# EAGLE design Micro DAQ Board.5 (EAGLE 5.06)
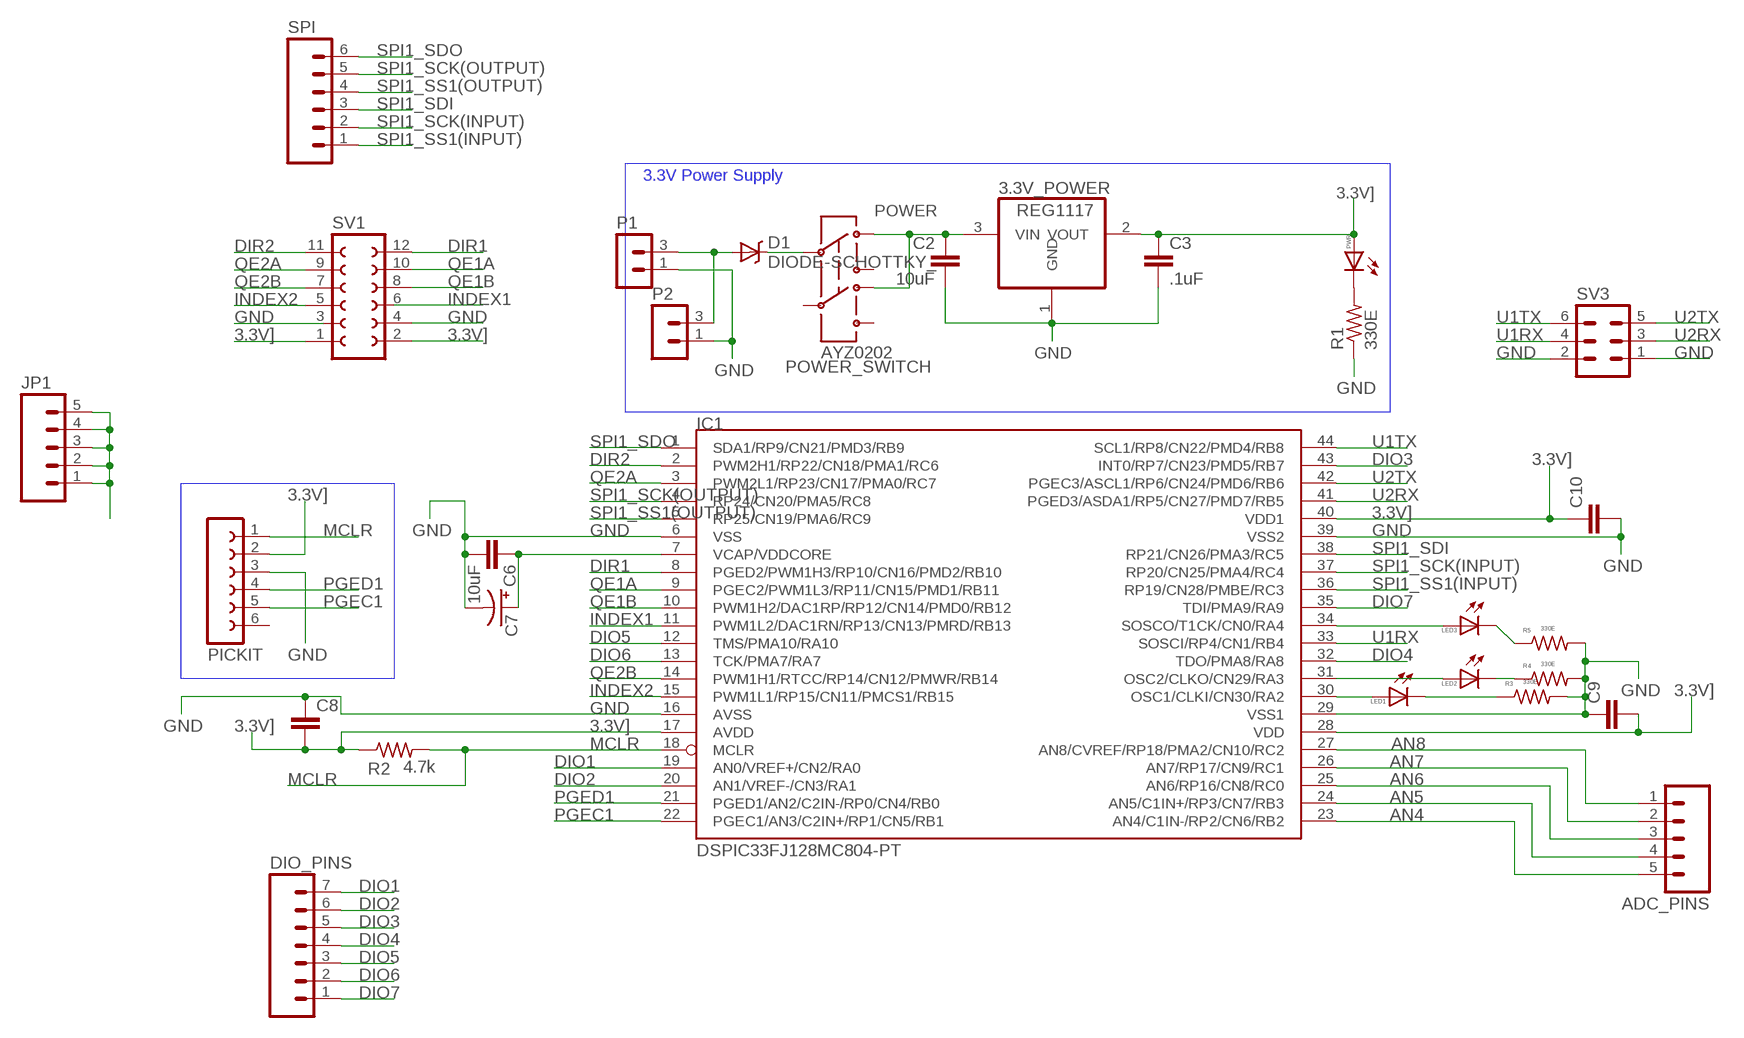
[diagram p0: schematic, sheet 1]

## Parts
3.3V_POWER  REG1117  [SOT223]
ADC_PINS  M05PTH_LONGPADS  [1X05_LONGPADS]
C2  10uF  C-EUC0805  [C0805]
C3  .1uF  C-EUC0805  [C0805]
C6  10uF  C-EUC0805  [C0805]
C7  CPOL-USE2.5-6  [E2,5-6]
C8  C-EUC0805  [C0805]
C9  C-EUC0805  [C0805]
C10  C-EUC0805  [C0805]
D1  DIODE-SCHOTTKY_  [SMA-DIODE]
DIO_PINS  M07LOCK_LONGPADS  [1X07_LOCK_LONGPADS]
IC1  DSPIC33FJ128MC804-PT  [TQFP44]
JP1  M05PTH_LONGPADS  [1X05_LONGPADS]
LED1  LEDCHIPLED_0805  [CHIPLED_0805]
LED2  LEDCHIPLED_0805  [CHIPLED_0805]
LED3  LEDCHIPLED_0805  [CHIPLED_0805]
P1  MA02-1  [MA02-1]
P2  MA02-1  [MA02-1]
PICKIT  FE06-1  [FE06]
POWER_SWITCH  AYZ0202  [AYZ0202]
PWR  LEDCHIPLED_0805  [CHIPLED_0805]
R1  330E  R-US_R0805  [R0805]
R2  4.7k  R-US_R0805  [R0805]
R3  330E  R-US_R0805  [R0805]
R4  330E  R-US_R0805  [R0805]
R5  330E  R-US_R0805  [R0805]
SPI  M06LONGPADS  [1X06_LONGPADS]
SV1  FE06-2  [FE06-2]
SV3  ML6  [ML6]

## Nets
3.3V]: 3.3V_POWER.2(VOUT) C3.1 C8.2 C9.2 C10.1 IC1.17(AVDD) IC1.28(VDD) IC1.40(VDD1) PICKIT.2 PWR.A R2.1 SV1.1 SV1.2
AN4: ADC_PINS.5 IC1.23(AN4/C1IN-/RP2/CN6/RB2)
AN5: ADC_PINS.4 IC1.24(AN5/C1IN+/RP3/CN7/RB3)
AN6: ADC_PINS.3 IC1.25(AN6/RP16/CN8/RC0)
AN7: ADC_PINS.2 IC1.26(AN7/RP17/CN9/RC1)
AN8: ADC_PINS.1 IC1.27(AN8/CVREF/RP18/PMA2/CN10/RC2)
DIO1: DIO_PINS.7 IC1.19(AN0/VREF+/CN2/RA0)
DIO2: DIO_PINS.6 IC1.20(AN1/VREF-/CN3/RA1)
DIO3: DIO_PINS.5 IC1.43(INT0/RP7/CN23/PMD5/RB7)
DIO4: DIO_PINS.4 IC1.32(TDO/PMA8/RA8)
DIO5: DIO_PINS.3 IC1.12(TMS/PMA10/RA10)
DIO6: DIO_PINS.2 IC1.13(TCK/PMA7/RA7)
DIO7: DIO_PINS.1 IC1.35(TDI/PMA9/RA9)
DIR1: IC1.8(PGED2/PWM1H3/RP10/CN16/PMD2/RB10) SV1.12
DIR2: IC1.2(PWM2H1/RP22/CN18/PMA1/RC6) SV1.11
GND: 3.3V_POWER.1(GND) C2.2 C3.2 C6.2 C7.- C8.1 C9.1 C10.2 IC1.6(VSS) IC1.16(AVSS) IC1.29(VSS1) IC1.39(VSS2) JP1.1 JP1.2 JP1.3 JP1.4 JP1.5 P1.1 P2.1 PICKIT.3 R1.1 R3.2 R4.2 R5.2 SV1.4 SV3.1 SV3.2
INDEX1: IC1.11(PWM1L2/DAC1RN/RP13/CN13/PMRD/RB13)
INDEX2: IC1.15(PWM1L1/RP15/CN11/PMCS1/RB15) SV1.5
MCLR: IC1.18(MCLR) PICKIT.1 R2.2
N$1: IC1.30(OSC1/CLKI/CN30/RA2) LED1.A
N$2: LED1.C R3.1
N$3: IC1.31(OSC2/CLKO/CN29/RA3) LED2.A
N$4: LED2.C R4.1
N$5: LED3.C R5.1
N$6: IC1.34(SOSCO/T1CK/CN0/RA4) LED3.A
N$7: D1.A P1.3 P2.3
N$8: D1.C POWER_SWITCH.2
N$15: PWR.C R1.2
PGEC1: IC1.22(PGEC1/AN3/C2IN+/RP1/CN5/RB1) PICKIT.5
PGED1: IC1.21(PGED1/AN2/C2IN-/RP0/CN4/RB0) PICKIT.4
POWER: 3.3V_POWER.3(VIN) C2.1 POWER_SWITCH.3 POWER_SWITCH.6
QE1A: IC1.9(PGEC2/PWM1L3/RP11/CN15/PMD1/RB11) SV1.10
QE1B: IC1.10(PWM1H2/DAC1RP/RP12/CN14/PMD0/RB12) SV1.8
QE2A: IC1.3(PWM2L1/RP23/CN17/PMA0/RC7) SV1.9
QE2B: IC1.14(PWM1H1/RTCC/RP14/CN12/PMWR/RB14) SV1.7
SPI1_SCK(INPUT): IC1.37(RP20/CN25/PMA4/RC4) SPI.2
SPI1_SCK(OUTPUT): IC1.4(RP24/CN20/PMA5/RC8) SPI.5
SPI1_SDI: IC1.38(RP21/CN26/PMA3/RC5) SPI.3
SPI1_SDO: IC1.1(SDA1/RP9/CN21/PMD3/RB9) SPI.6
SPI1_SS1(INPUT): IC1.36(RP19/CN28/PMBE/RC3) SPI.1
SPI1_SS1(OUTPUT): IC1.5(RP25/CN19/PMA6/RC9) SPI.4
U1RX: IC1.33(SOSCI/RP4/CN1/RB4) SV3.4
U1TX: IC1.44(SCL1/RP8/CN22/PMD4/RB8) SV3.6
U2RX: IC1.41(PGED3/ASDA1/RP5/CN27/PMD7/RB5) SV3.3
U2TX: IC1.42(PGEC3/ASCL1/RP6/CN24/PMD6/RB6) SV3.5
VCAP/VDDCORE: C6.1 C7.+ IC1.7(VCAP/VDDCORE)
Unconnected: PICKIT.6 POWER_SWITCH.1 POWER_SWITCH.4 POWER_SWITCH.5 SV1.3 SV1.6

## Notes on the sheet
- 3.3V Power Supply

## Library data of the parts
3.3V_POWER = burr-brown:REG1117: 800mA and 1A Low Dropout (LDO) Positive Regulator 1.8V, 2.5V, 2.85V, 3.3V, 5V, and Adj
ADC_PINS JP1 = SparkFun:M05: Header 5 Standard 5-pin 0.1" header. Use with straight break away headers (SKU : PRT-00116), right angle break away headers (PRT-00553), swiss pins (PRT-00743), machine pins (PRT-00117), and female headers (PRT-00115). Molex polarized connector foot print use with SKU : PRT-08230 with associated crimp pins and housings.
C2 C3 C6 C8-C10 = rcl:C-EU: CAPACITOR, European symbol
C7 = rcl:CPOL-US: POLARIZED CAPACITOR, American symbol
D1 = SparkFun:DIODE-SCHOTTKY
DIO_PINS = SparkFun:M07: Header 7 Standard 7-pin 0.1" header. Use with straight break away headers (SKU : PRT-00116), right angle break away headers (PRT-00553), swiss pins (PRT-00743), machine pins (PRT-00117), and female headers (PRT-00115). NOTES ON THE VARIANTS LOCK and LOCK_LONGPADS... This footprint was designed to help hold the alignment of a through-hole component (i.e. 7-pin header) while soldering it into place. You may notice that each hole has been shifted either up or down by 0.005 of an inch from it's more standard position (which is usually a perfectly straight line). This slight alteration caused the pins (the squares in the middle) to touch the edges of the holes. Because they are alternating, it causes a "brace" to hold the header in place. 0.005 has proven to be the perfect amount of "off-center" position when using our standard breakaway headers. Although looks a little odd when you look at the bare footprint, once you have a header in there, the alteration is very hard to notice. Also, if you push a header all the way into place, it is covered up entirely on the bottom side. This idea of altering the position of holes to aid alignment will be further integrated into the Sparkfun Library for other footprints. It can help hold any component with 3 or more connection pins.
IC1 = microchip-dspic33fjxxmc:DSPIC33FJ128MC804: dsPIC33FJ32MC302/304, dsPIC33FJ64MCX02/X04, AND dsPIC33FJ128MCX02/X04 High-Performance, 16-bit Digital Signal Controllers Package:44 Pin TQFP Operating Range: * Up to 40 MIPS operation (at 3.0V -3.6V): - Industrial temperature range (-40°C to +85°C) - Extended temperature range (-40°C to +125°C) High-Performance DSC CPU: * Modified Harvard architecture * C compiler optimized instruction set * 16-bit wide data path * 24-bit wide instructions * Linear program memory addressing up to 4M instruction words * Linear data memory addressing up to 64 Kbytes * 83 base instructions: mostly 1 word/1 cycle * Two 40-bit accumulators with rounding and saturation options * Flexible and powerful addressing modes: - Indirect - Modulo - Bit-Reversed * Software stack * 16 x 16 fractional/integer multiply operations * 32/16 and 16/16 divide operations * Single-cycle multiply and accumulate: - Accumulator write back for DSP operations - Dual data fetch * Up to ±16-bit shifts for up to 40-bit data Direct Memory Access (DMA): * 8-channel hardware DMA * Up to 2 Kbytes dual ported DMA buffer area (DMA RAM) to store data transferred via DMA: - Allows data transfer between RAM and a peripheral while CPU is executing code (no cycle stealing) * Most peripherals support DMA Timers/Capture/Compare/PWM: * Timer/Counters, up to five 16-bit timers: - Can pair up to make two 32-bit timers - One timer runs as a Real-Time Clock with an external 32.768 kHz oscillator - Programmable prescaler * Input Capture (up to four channels): - Capture on up, down or both edges - 16-bit capture input functions - 4-deep FIFO on each capture * Output Compare (up to four channels): - Single or Dual 16-bit Compare mode - 16-bit Glitchless PWM mode * Hardware Real-Time Clock/Calendar (RTCC): - Provides clock, calendar, and alarm functions Interrupt Controller: * 5-cycle latency * Up to 53 available interrupt sources * Up to three external interrupts * Seven programmable priority levels * Five processor exceptions Digital I/O: * Peripheral pin Select functionality * Up to 35 programmable digital I/O pins * Wake-up/Interrupt-on-Change for up to 31 pins * Output pins can drive from 3.0V to 3.6V * Up to 5V output with open drain configuration * All digital input pins are 5V tolerant * 4 mA sink on all I/O pins On-Chip Flash and SRAM: * Flash program memory (up to 128 Kbytes) * Data SRAM (up to 16 Kbytes) * Boot, Secure, and General Security for program Flash System Management: * Flexible clock options: - External, crystal, resonator, internal RC - Fully integrated Phase-Locked Loop (PLL) - Extremely low jitter PLL * Power-up Timer * Oscillator Start-up Timer/Stabilizer * Watchdog Timer with its own RC oscillator * Fail-Safe Clock Monitor * Reset by multiple sources Power Management: * On-chip 2.5V voltage regulator * Switch between clock sources in real time * Idle, Sleep, and Doze modes with fast wake-up Analog-to-Digital Converters (ADCs): * 10-bit, 1.1 Msps or 12-bit, 500 Ksps conversion: - Two and four simultaneous samples (10-bit ADC) - Up to nine input channels with auto-scanning - Conversion start can be manual or synchronized with one of four trigger sources - Conversion possible in Sleep mode - ±2 LSb max integral nonlinearity - ±1 LSb max differential nonlinearity Audio Digital-to-Analog Converter (DAC): - 16-bit Dual Channel DAC module - 100 Ksps maximum sampling rate - Second-Order Digital Delta-Sigma Modulator Comparator Module: * Two analog comparators with programmable input/output configuration CMOS Flash Technology: * Low-power, high-speed Flash technology * Fully static design * 3.3V (±10%) operating voltage * Industrial and Extended temperature * Low power consumption Motor Control Peripherals: * 6-channel 16-bit Motor Control PWM: - Three duty cycle generators - Independent or Complementary mode - Programmable dead-time and output polarity - Edge-aligned or center-aligned - Manual output override control - One Fault input - Trigger for ADC conversions - PWM frequency for 16-bit resolution (@ 40 MIPS) = 1220 Hz for Edge-Aligned mode, 610 Hz for Center-Aligned mode - PWM frequency for 11-bit resolution (@ 40 MIPS) = 39.1 kHz for Edge-Aligned mode, 19.55 kHz for Center-Aligned mode * 2-channel 16-bit Motor Control PWM: - One duty cycle generator - Independent or Complementary mode - Programmable dead time and output polarity - Edge-aligned or center-aligned - Manual output override control - One Fault input - Trigger for ADC conversions - PWM frequency for 16-bit resolution (@ 40 MIPS) = 1220 Hz for Edge-Aligned mode, 610 Hz for Center-Aligned mode - PWM frequency for 11-bit resolution (@ 40 MIPS) = 39.1 kHz for Edge-Aligned mode, 19.55 kHz for Center-Aligned mode * 2-Quadrature Encoder Interface module: - Phase A, Phase B, and index pulse input - 16-bit up/down position counter - Count direction status - Position Measurement (x2 and x4) mode - Programmable digital noise filters on inputs - Alternate 16-bit Timer/Counter mode - Interrupt on position counter rollover/underflow
LED1-LED3 PWR = led:LED: LED OSRAM: - CHIPLED LG R971, LG N971, LY N971, LG Q971, LY Q971, LO R971, LY R971 LH N974, LH R974 LS Q976, LO Q976, LY Q976 LO Q996 - Hyper CHIPLED LW Q18S LB Q993, LB Q99A, LB R99A - SideLED LS A670, LO A670, LY A670, LG A670, LP A670 LB A673, LV A673, LT A673, LW A673 LH A674 LY A675 LS A676, LA A676, LO A676, LY A676, LW A676 LS A679, LY A679, LG A679 - Hyper Micro SIDELED® LS Y876, LA Y876, LO Y876, LY Y876 LT Y87S - SmartLED LW L88C, LW L88S LB L89C, LB L89S, LG L890 LS L89K, LO L89K, LY L89K LS L896, LA L896, LO L896, LY L896 - TOPLED LS T670, LO T670, LY T670, LG T670, LP T670 LSG T670, LSP T670, LSY T670, LOP T670, LYG T670 LG T671, LOG T671, LSG T671 LB T673, LV T673, LT T673, LW T673 LH T674 LS T676, LA T676, LO T676, LY T676, LB T676, LH T676, LSB T676, LW T676 LB T67C, LV T67C, LT T67C, LS T67K, LO T67K, LY T67K, LW E67C LS E67B, LA E67B, LO E67B, LY E67B, LB E67C, LV E67C, LT E67C LW T67C LS T679, LY T679, LG T679 LS T770, LO T770, LY T770, LG T770, LP T770 LB T773, LV T773, LT T773, LW T773 LH T774 LS E675, LA E675, LY E675, LS T675 LS T776, LA T776, LO T776, LY T776, LB T776 LHGB T686 LT T68C, LB T68C - Hyper Mini TOPLED® LB M676 - Mini TOPLED Santana® LG M470 LS M47K, LO M47K, LY M47K Source: http://www.osram.convergy.de LUXEON: - LUMILED® LXK2-PW12-R00, LXK2-PW12-S00, LXK2-PW14-U00, LXK2-PW14-V00 LXK2-PM12-R00, LXK2-PM12-S00, LXK2-PM14-U00 LXK2-PE12-Q00, LXK2-PE12-R00, LXK2-PE12-S00, LXK2-PE14-T00, LXK2-PE14-U00 LXK2-PB12-K00, LXK2-PB12-L00, LXK2-PB12-M00, LXK2-PB14-N00, LXK2-PB14-P00, LXK2-PB14-Q00 LXK2-PR12-L00, LXK2-PR12-M00, LXK2-PR14-Q00, LXK2-PR14-R00 LXK2-PD12-Q00, LXK2-PD12-R00, LXK2-PD12-S00 LXK2-PH12-R00, LXK2-PH12-S00 LXK2-PL12-P00, LXK2-PL12-Q00, LXK2-PL12-R00 Source: www.luxeon.com KINGBRIGHT: KA-3528ASYC Source: www.kingbright.com
P1 P2 = Pranjal:MA02-1
PICKIT = con-lsta:FE06-1: FEMALE HEADER
POWER_SWITCH = SparkFun:AYZ0202: SPDT Slide Switch Simple SMD single-pull double-throw slide switch. Good for less than 350mA power switch, switching UARTs between devices, etc. Spark Fun Electronics SKU : COM-00597
R1-R5 = rcl:R-US_: RESISTOR, American symbol
SPI = SparkFun:M06: Header 6 Standard 6-pin 0.1" header. Use with straight break away headers (SKU : PRT-00116), right angle break away headers (PRT-00553), swiss pins (PRT-00743), machine pins (PRT-00117), and female headers (PRT-00115). Molex polarized connector foot print use with SKU : PRT-08094 with associated crimp pins and housings. NOTES ON THE VARIANTS LOCK and LOCK_LONGPADS... This footprint was designed to help hold the alignment of a through-hole component (i.e. 6-pin header) while soldering it into place. You may notice that each hole has been shifted either up or down by 0.005 of an inch from it's more standard position (which is a perfectly straight line). This slight alteration caused the pins (the squares in the middle) to touch the edges of the holes. Because they are alternating, it causes a "brace" to hold the component in place. 0.005 has proven to be the perfect amount of "off-center" position when using our standard breakaway headers. Although looks a little odd when you look at the bare footprint, once you have a header in there, the alteration is very hard to notice. Also, if you push a header all the way into place, it is covered up entirely on the bottom side. This idea of altering the position of holes to aid alignment will be further integrated into the Sparkfun Library for other footprints. It can help hold any component with 3 or more connection pins.
SV1 = con-lsta:FE06-2: FEMALE HEADER
SV3 = con-ml:ML6: HARTING

## Board
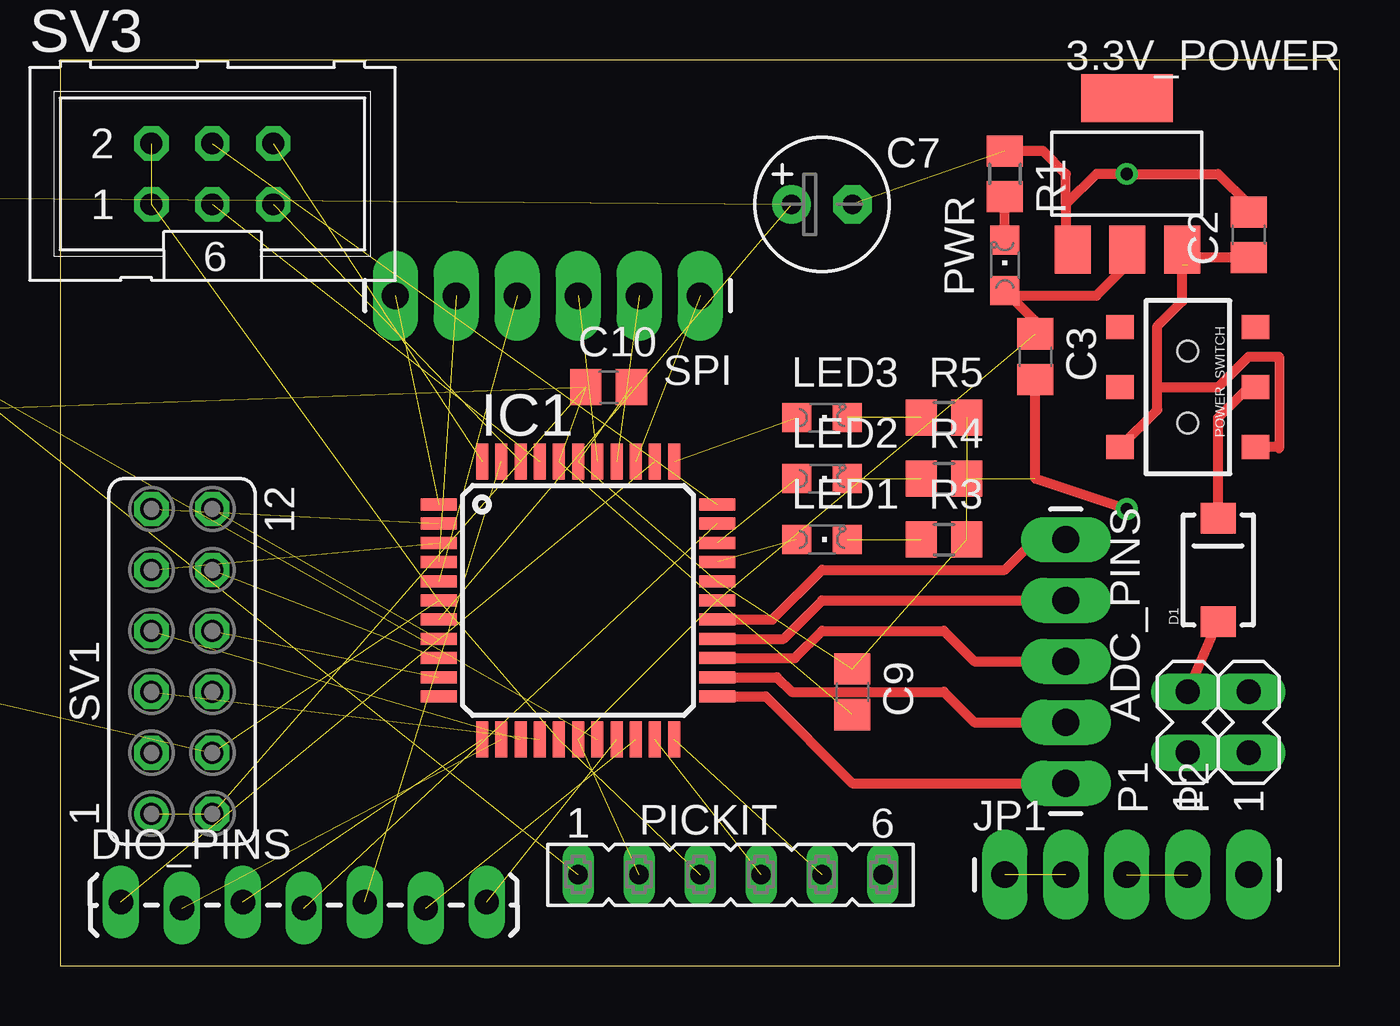
[diagram p1: board, top side]
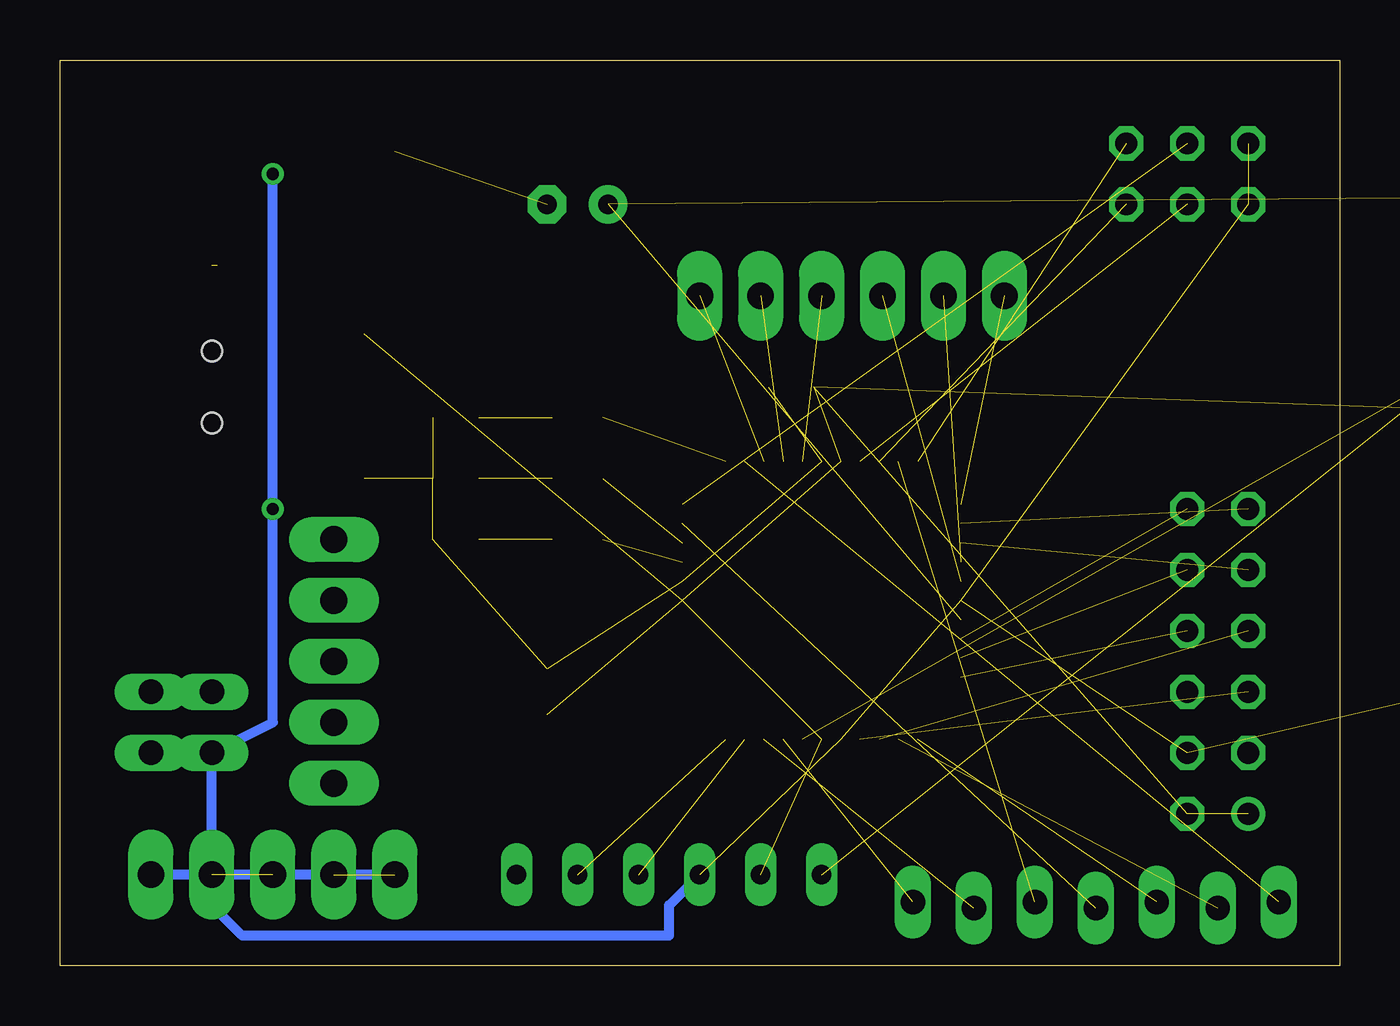
[diagram p2: board, bottom side, seen from below]

Size 53.32 x 37.77 mm. Coordinates in mm from the lower left corner, seen from the top.
Outline: 0,0 53.32,0 53.32,37.77 0,37.77 0,0
Copper layers (1*16): Top 0.035mm / dielectric 1.5mm / Bottom 0.035mm
Design rules "default *": minimum track width 10mil, minimum drill 24mil, track to track 6mil, track to pad 8mil, pad to pad 8mil, via to via 8mil, smd to smd 8mil, copper to edge 40mil, drill to drill 8mil, minimum pad ring 10mil, minimum via ring 8mil, stop-mask expansion 4mil, vias tented up to drill 0mil, thermal gap 10mil

### Footprints (pad centres in the part's own frame; a part is rotated, then mirrored left to right if it is on the bottom)
SOT223 = smd 1.499 x 2.007: 1 -2.261,-3.15; 2 0.025,-3.15; 3 2.311,-3.15 | smd 3.81 x 2.007: 4 0,3.15
1X05_LONGPADS = drill 1.118 pad 1.88 long: 1 0,0; 2 2.54,0; 3 5.08,0; 4 7.62,0; 5 10.16,0
C0805 = smd 1.3 x 1.5: 1 -0.95,0; 2 0.95,0
E2,5-6 = drill 0.813 pad 1.6 round: + -1.27,0 | drill 0.813 pad 1.6 octagon: - 1.27,0
SMA-DIODE = smd 1.27 x 1.47: A -2.15,0; C 2.15,0
1X07_LOCK_LONGPADS = drill 1.016 long: 1 0,0.127; 2 2.54,-0.127; 3 5.08,0.127; 4 7.62,-0.127; 5 10.16,0.127; 6 12.7,-0.127; 7 15.24,0.127
TQFP44 = smd 1.5 x 0.5: 1 -5.8,4; 2 -5.8,3.2; 3 -5.8,2.4; 4 -5.8,1.6; 5 -5.8,0.8; 6 -5.8,0; 7 -5.8,-0.8; 8 -5.8,-1.6; 9 -5.8,-2.4; 10 -5.8,-3.2; 11 -5.8,-4; 23 5.8,-4; 24 5.8,-3.2; 25 5.8,-2.4; 26 5.8,-1.6; 27 5.8,-0.8; 28 5.8,0; 29 5.8,0.8; 30 5.8,1.6; 31 5.8,2.4; 32 5.8,3.2; 33 5.8,4 | smd 0.5 x 1.5: 12 -4,-5.8; 13 -3.2,-5.8; 14 -2.4,-5.8; 15 -1.6,-5.8; 16 -0.8,-5.8; 17 0,-5.8; 18 0.8,-5.8; 19 1.6,-5.8; 20 2.4,-5.8; 21 3.2,-5.8; 22 4,-5.8; 34 4,5.8; 35 3.2,5.8; 36 2.4,5.8; 37 1.6,5.8; 38 0.8,5.8; 39 0,5.8; 40 -0.8,5.8; 41 -1.6,5.8; 42 -2.4,5.8; 43 -3.2,5.8; 44 -4,5.8
CHIPLED_0805 = smd 1.2 x 1.2: A 0,-1.05; C 0,1.05
MA02-1 = drill 1.016 long: 1 -1.27,0; 3 1.27,0
FE06 = drill 0.813 long: 1 -6.35,0; 2 -3.81,0; 3 -1.27,0; 4 1.27,0; 5 3.81,0; 6 6.35,0
AYZ0202 = smd 1 x 1.15: 1 -2.5,2.825; 2 0,2.825; 3 2.5,2.825; 4 -2.5,-2.825; 5 0,-2.825; 6 2.5,-2.825 | hole 0.85: 1.5,0; -1.5,0
R0805 = smd 1.3 x 1.5: 1 -0.95,0; 2 0.95,0
1X06_LONGPADS = drill 1.118 pad 1.88 long: 1 0,0; 2 2.54,0; 3 5.08,0; 4 7.62,0; 5 10.16,0; 6 12.7,0
FE06-2 = drill 0.914 round: 1 -6.35,1.27 | drill 0.914 octagon: 2 -6.35,-1.27; 3 -3.81,1.27; 4 -3.81,-1.27; 5 -1.27,1.27; 6 -1.27,-1.27; 7 1.27,1.27; 8 1.27,-1.27; 9 3.81,1.27; 10 3.81,-1.27; 11 6.35,1.27; 12 6.35,-1.27
ML6 = drill 0.914 octagon: 1 -2.54,-1.27; 2 -2.54,1.27; 3 0,-1.27; 4 0,1.27; 5 2.54,-1.27; 6 2.54,1.27

### Placement (x,y rotation side)
3.3V_POWER  44.45,33.02 0 top
ADC_PINS  41.91,17.78 270 top
C2  49.53,30.48 90 top
C3  40.64,25.4 270 top
C6  -11.43,33.02 90 top  (outside the outline)
C7  31.75,31.75 0 top
C8  -11.43,13.97 90 top  (outside the outline)
C9  33.02,11.43 270 top
C10  22.86,24.13 0 top
D1  48.26,16.51 90 top
DIO_PINS  2.54,2.54 0 top
IC1  21.59,15.24 0 top
JP1  39.37,3.81 0 top
LED1  31.75,17.78 270 top
LED2  31.75,20.32 270 top
LED3  31.75,22.86 270 top
P1  46.99,10.16 90 top
P2  49.53,10.16 90 top
PICKIT  27.94,3.81 0 top
POWER_SWITCH  46.99,24.13 270 top
PWR  39.37,29.21 0 top
R1  39.37,33.02 270 top
R2  -5.08,24.13 90 top  (outside the outline)
R3  36.83,17.78 0 top
R4  36.83,20.32 0 top
R5  36.83,22.86 0 top
SPI  26.67,27.94 180 top
SV1  5.08,12.7 90 top
SV3  6.35,33.02 0 top

### Tracks (layer width: path | path; a pad name or v marks a point on that pad's centre or on a via)
3.3V]  (10 unrouted)
  Top 0.406: 3.3V_POWER.2 44.48,29.23 43.18,27.94 39.59,27.94 PWR.A 40.64,26.89 C3.1
AN4
  Top 0.406: IC1.23 29.4,11.24 33.02,7.62 ADC_PINS.5
AN5
  Top 0.406: IC1.24 29.87,12.04 30.48,11.43 36.83,11.43 38.1,10.16 ADC_PINS.4
AN6
  Top 0.406: IC1.25 30.62,12.84 31.75,13.97 36.83,13.97 38.1,12.7 ADC_PINS.3
AN7
  Top 0.406: IC1.26 30.15,13.64 31.75,15.24 ADC_PINS.2
AN8
  Top 0.406: IC1.27 29.68,14.44 31.75,16.51 39.37,16.51 40.64,17.78 ADC_PINS.1
DIO1  (1 unrouted)
DIO2  (1 unrouted)
DIO3  (1 unrouted)
DIO4  (1 unrouted)
DIO5  (1 unrouted)
DIO6  (1 unrouted)
DIO7  (1 unrouted)
DIR1  (1 unrouted)
DIR2  (1 unrouted)
GND  (via drill 0.51)  (17 unrouted)
  Top 0.406: P1.1 P2.1 | C2.2 49.53,31.75 48.26,33.02 v44.45,33.02 43.18,33.02 41.91,31.75 | 41.91,31.75 41.91,30.15 3.3V_POWER.1 | R1.1 40.96,33.97 41.91,33.02 41.91,31.75 | C3.2 40.64,20.32 v44.45,19.05
  Bottom 0.406: v44.45,33.02 v44.45,19.05 44.45,10.16 P1.1 JP1.4 | JP1.1 JP1.4 | JP1.4 JP1.5 | JP1.4 46.99,2.54 45.72,1.27 27.94,1.27 27.94,2.54 PICKIT.3
INDEX2  (1 unrouted)
MCLR  (2 unrouted)
N$1  (1 unrouted)
N$2  (1 unrouted)
N$3  (1 unrouted)
N$4  (1 unrouted)
N$5  (1 unrouted)
N$6  (1 unrouted)
N$7
  Top 0.406: D1.A P1.3 P2.3
N$8
  Top 0.254: 49.53,24.13 POWER_SWITCH.2
  Top 0.406: 49.53,24.13 48.26,22.86 D1.C
N$15
  Top 0.406: PWR.C R1.2
PGEC1  (1 unrouted)
PGED1  (1 unrouted)
POWER  (1 unrouted)
  Top 0.406: POWER_SWITCH.3 50.76,21.63 50.8,21.59 50.8,25.4 49.53,25.4 48.26,24.13 45.72,24.13 | 45.72,24.13 45.72,23.19 POWER_SWITCH.6 | 45.72,24.13 45.72,26.67 46.76,27.71 3.3V_POWER.3 | C2.1 46.99,29.53 46.99,29.21
QE1A  (1 unrouted)
QE1B  (1 unrouted)
QE2A  (1 unrouted)
QE2B  (1 unrouted)
SPI1_SCK(INPUT)  (1 unrouted)
SPI1_SCK(OUTPUT)  (1 unrouted)
SPI1_SDI  (1 unrouted)
SPI1_SDO  (1 unrouted)
SPI1_SS1(INPUT)  (1 unrouted)
SPI1_SS1(OUTPUT)  (1 unrouted)
U1RX  (1 unrouted)
U1TX  (1 unrouted)
U2RX  (1 unrouted)
U2TX  (1 unrouted)
VCAP/VDDCORE  (2 unrouted)